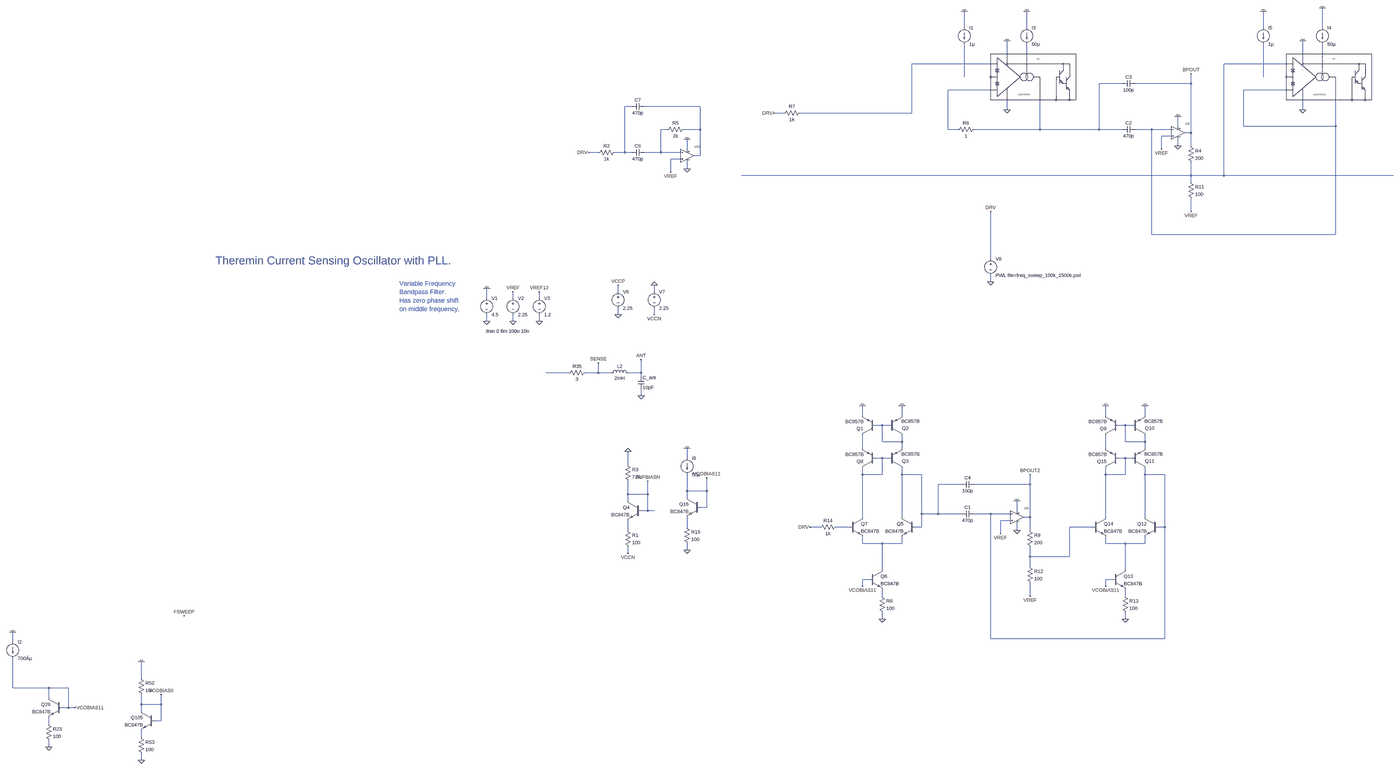
[diagram p0: schematic vco_and_lc_drive_v11.asc, whole sheet]
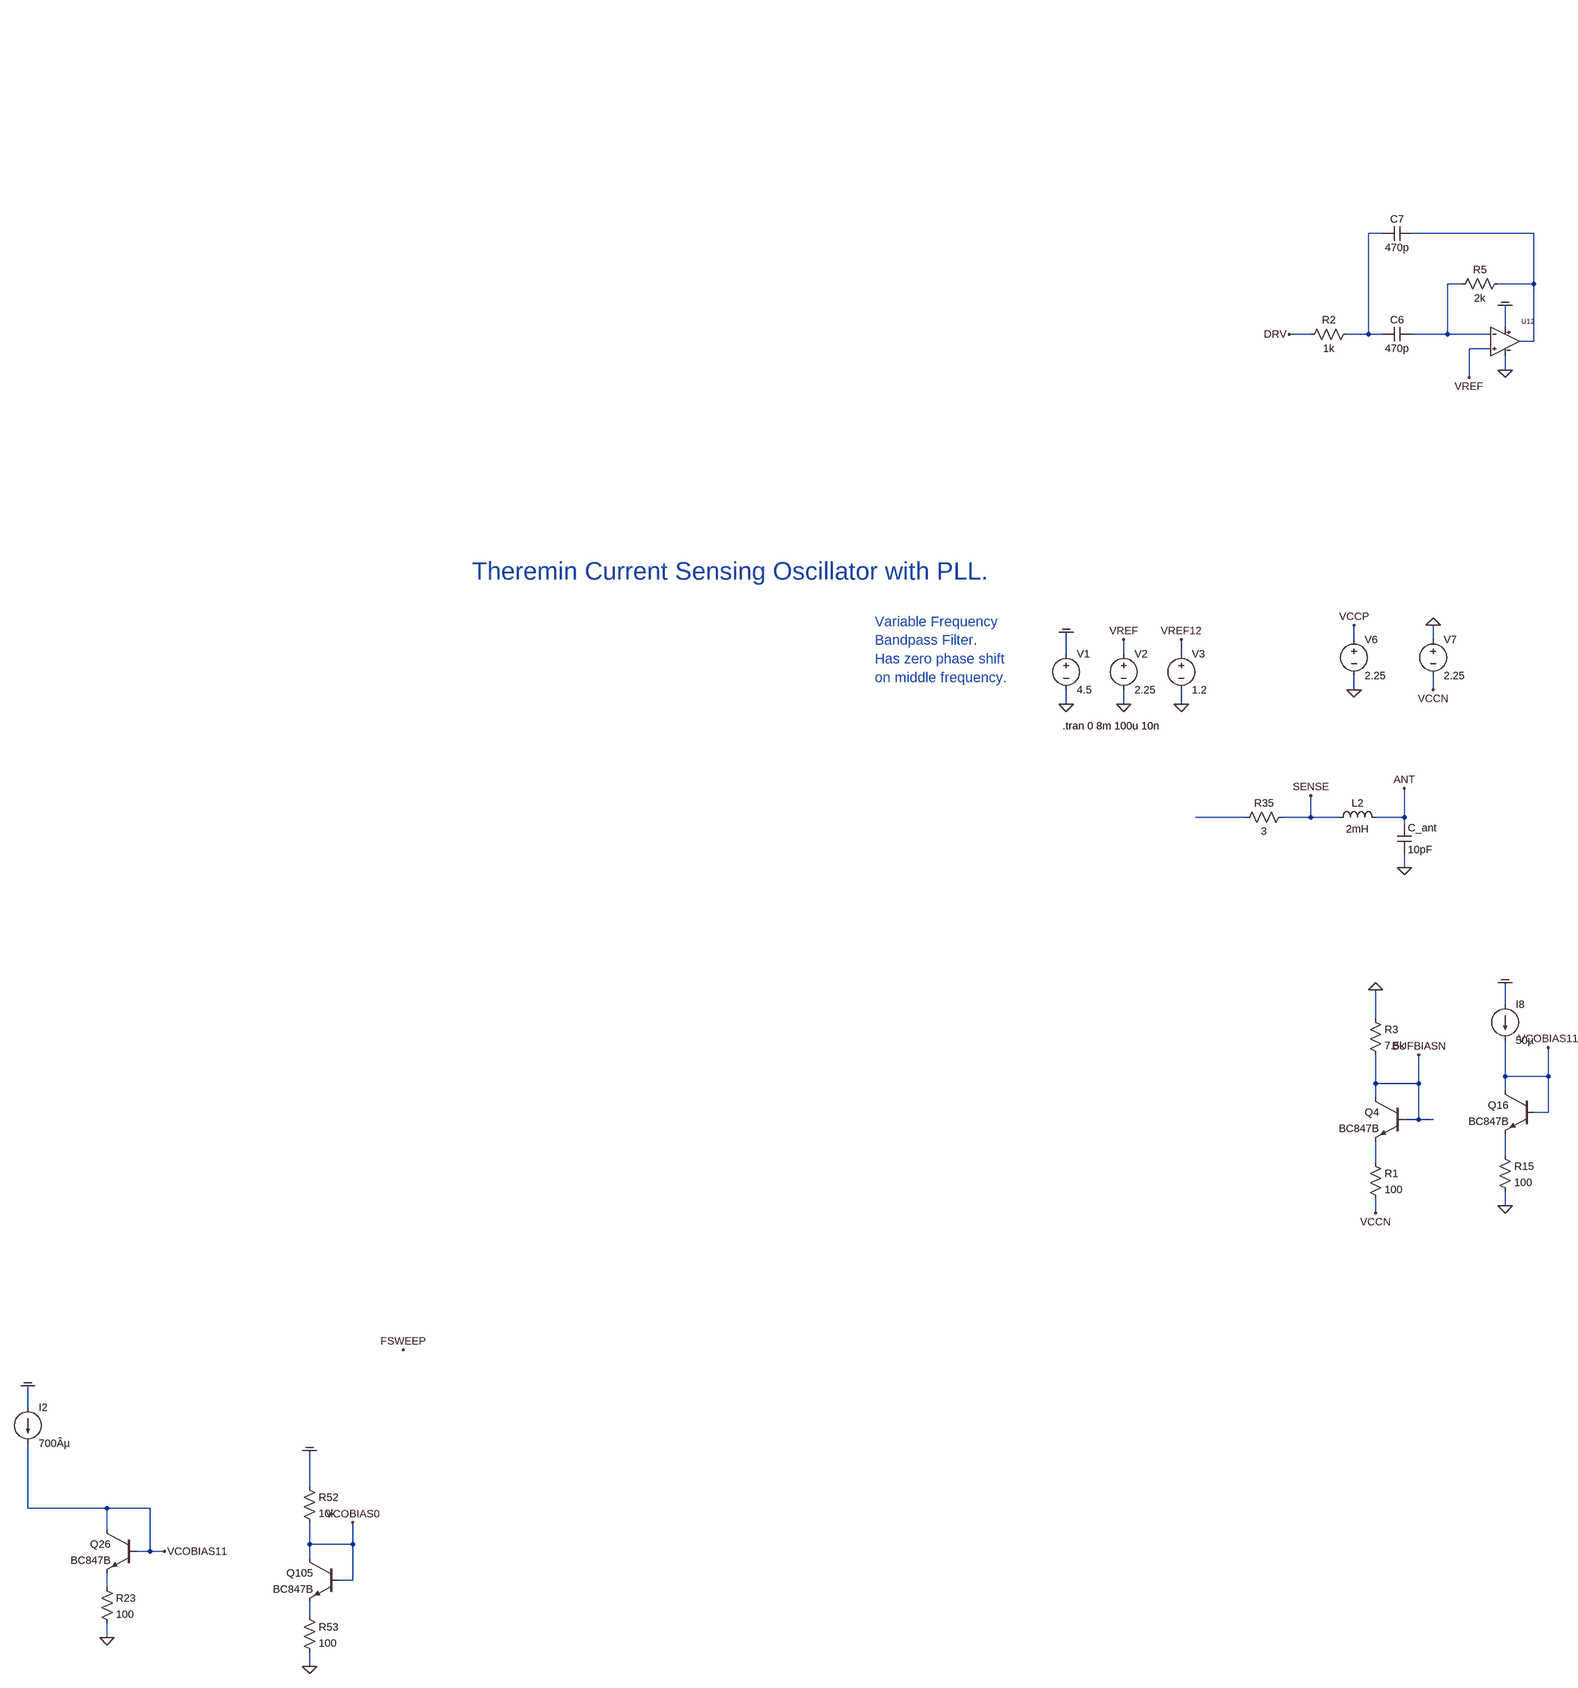
[diagram p1: schematic vco_and_lc_drive_v11.asc, part, row 1 of 1, column 1 of 2]
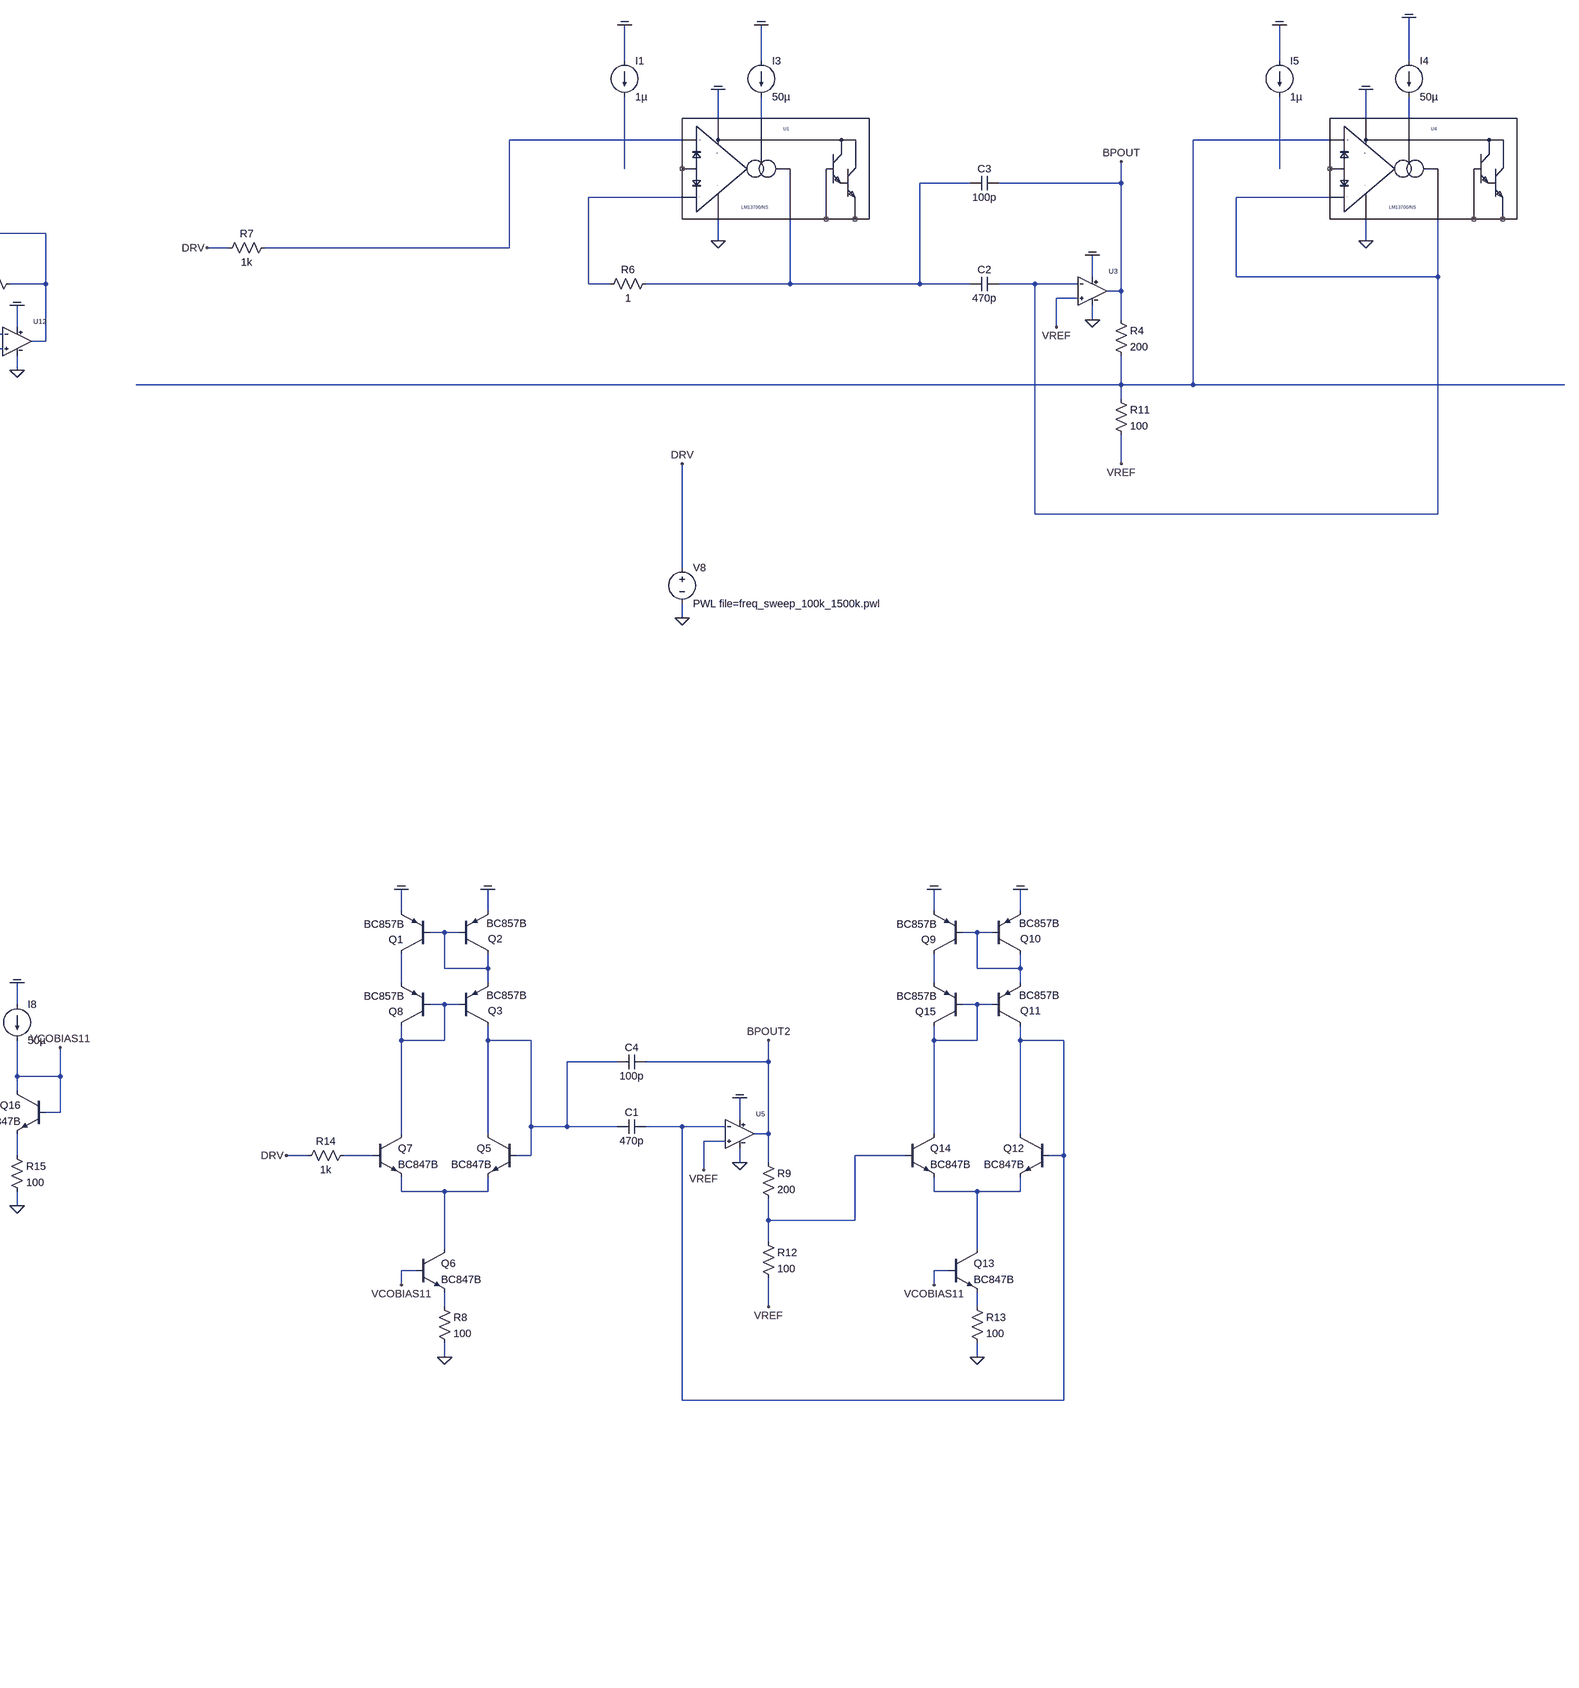
[diagram p2: schematic vco_and_lc_drive_v11.asc, part, row 1 of 1, column 2 of 2]
vco_and_lc_drive_v11.asc, the LTspice schematic file:
Version 4
SHEET 1 13504 24832
WIRE -2160 17680 -2160 17600
WIRE -1856 17680 -1856 17600
WIRE -704 17680 -704 17600
WIRE -416 17680 -416 17584
WIRE -1952 17808 -1952 17744
WIRE -1856 17808 -1856 17760
WIRE -512 17808 -512 17744
WIRE -416 17808 -416 17760
WIRE -2032 17856 -2416 17856
WIRE -592 17856 -896 17856
WIRE -2160 17920 -2160 17760
WIRE -704 17920 -704 17760
WIRE -1392 17952 -1504 17952
WIRE -1056 17952 -1056 17904
WIRE -1056 17952 -1328 17952
WIRE -2032 17984 -2240 17984
WIRE -592 17984 -800 17984
WIRE -4896 18064 -4928 18064
WIRE -4560 18064 -4832 18064
WIRE -1952 18080 -1952 18032
WIRE -512 18080 -512 18032
WIRE -3040 18096 -3088 18096
WIRE -2416 18096 -2416 17856
WIRE -2416 18096 -2960 18096
WIRE -1120 18160 -1120 18112
WIRE -800 18160 -800 17984
WIRE -352 18160 -352 18032
WIRE -352 18160 -800 18160
WIRE -4720 18176 -4752 18176
WIRE -4560 18176 -4560 18064
WIRE -4560 18176 -4640 18176
WIRE -2240 18176 -2240 17984
WIRE -2192 18176 -2240 18176
WIRE -1792 18176 -1792 18032
WIRE -1792 18176 -2112 18176
WIRE -1504 18176 -1504 17952
WIRE -1504 18176 -1792 18176
WIRE -1392 18176 -1504 18176
WIRE -1248 18176 -1328 18176
WIRE -1152 18176 -1248 18176
WIRE -1056 18192 -1056 17952
WIRE -1056 18192 -1088 18192
WIRE -1152 18208 -1200 18208
WIRE -1120 18256 -1120 18224
WIRE -1056 18256 -1056 18192
WIRE -4624 18272 -4624 18224
WIRE -1200 18272 -1200 18208
WIRE -5056 18288 -5104 18288
WIRE -4928 18288 -4928 18064
WIRE -4928 18288 -4976 18288
WIRE -4896 18288 -4928 18288
WIRE -4752 18288 -4752 18176
WIRE -4752 18288 -4832 18288
WIRE -4656 18288 -4752 18288
WIRE -4560 18304 -4560 18176
WIRE -4560 18304 -4592 18304
WIRE -4656 18320 -4704 18320
WIRE -4624 18368 -4624 18336
WIRE -4704 18384 -4704 18320
WIRE -1056 18400 -1056 18336
WIRE -1056 18400 -3328 18400
WIRE -896 18400 -896 17856
WIRE -896 18400 -1056 18400
WIRE 320 18400 -896 18400
WIRE -1056 18432 -1056 18400
WIRE -1056 18576 -1056 18512
WIRE -1248 18688 -1248 18176
WIRE -352 18688 -352 18160
WIRE -352 18688 -1248 18688
WIRE -2032 18880 -2032 18576
WIRE -2032 18992 -2032 18960
WIRE -4960 19040 -4960 19008
WIRE -4784 19040 -4784 19008
WIRE -5600 19072 -5600 19024
WIRE -5472 19072 -5472 19040
WIRE -5344 19072 -5344 19040
WIRE -4960 19152 -4960 19120
WIRE -4784 19152 -4784 19120
WIRE -5600 19184 -5600 19152
WIRE -5472 19184 -5472 19152
WIRE -5344 19184 -5344 19152
WIRE -5200 19440 -5312 19440
WIRE -5056 19440 -5056 19392
WIRE -5056 19440 -5120 19440
WIRE -4992 19440 -5056 19440
WIRE -4848 19440 -4848 19376
WIRE -4848 19440 -4912 19440
WIRE -4848 19456 -4848 19440
WIRE -4848 19552 -4848 19520
WIRE -2656 19648 -2656 19600
WIRE -2464 19648 -2464 19600
WIRE -1472 19648 -1472 19600
WIRE -1280 19648 -1280 19600
WIRE -2560 19696 -2592 19696
WIRE -2528 19696 -2560 19696
WIRE -1376 19696 -1408 19696
WIRE -1344 19696 -1376 19696
WIRE -2560 19776 -2560 19696
WIRE -2464 19776 -2464 19744
WIRE -2464 19776 -2560 19776
WIRE -1376 19776 -1376 19696
WIRE -1280 19776 -1280 19744
WIRE -1280 19776 -1376 19776
WIRE -2656 19808 -2656 19744
WIRE -2464 19808 -2464 19776
WIRE -1472 19808 -1472 19744
WIRE -1280 19808 -1280 19776
WIRE -4624 19856 -4624 19808
WIRE -2560 19856 -2592 19856
WIRE -2528 19856 -2560 19856
WIRE -1376 19856 -1408 19856
WIRE -1344 19856 -1376 19856
WIRE -4912 19888 -4912 19824
WIRE -2656 19936 -2656 19904
WIRE -2560 19936 -2560 19856
WIRE -2560 19936 -2656 19936
WIRE -2464 19936 -2464 19904
WIRE -2368 19936 -2464 19936
WIRE -1472 19936 -1472 19904
WIRE -1376 19936 -1376 19856
WIRE -1376 19936 -1472 19936
WIRE -1280 19936 -1280 19904
WIRE -1184 19936 -1280 19936
WIRE -2176 19984 -2288 19984
WIRE -1840 19984 -1840 19936
WIRE -1840 19984 -2112 19984
WIRE -4624 20016 -4624 19936
WIRE -4528 20016 -4528 19952
WIRE -4528 20016 -4624 20016
WIRE -4912 20032 -4912 19968
WIRE -4816 20032 -4816 19968
WIRE -4816 20032 -4912 20032
WIRE -4624 20048 -4624 20016
WIRE -4912 20064 -4912 20032
WIRE -4528 20096 -4528 20016
WIRE -4528 20096 -4560 20096
WIRE -4816 20112 -4816 20032
WIRE -4816 20112 -4848 20112
WIRE -4784 20112 -4816 20112
WIRE -1904 20112 -1904 20064
WIRE -2368 20128 -2368 19936
WIRE -2288 20128 -2288 19984
WIRE -2288 20128 -2368 20128
WIRE -2176 20128 -2288 20128
WIRE -2032 20128 -2112 20128
WIRE -1936 20128 -2032 20128
WIRE -2656 20144 -2656 19936
WIRE -2464 20144 -2464 19936
WIRE -1840 20144 -1840 19984
WIRE -1840 20144 -1872 20144
WIRE -1472 20144 -1472 19936
WIRE -1280 20144 -1280 19936
WIRE -1936 20160 -1984 20160
WIRE -4624 20192 -4624 20144
WIRE -2864 20192 -2912 20192
WIRE -2720 20192 -2784 20192
WIRE -2368 20192 -2368 20128
WIRE -2368 20192 -2400 20192
WIRE -1536 20192 -1648 20192
WIRE -1184 20192 -1184 19936
WIRE -1184 20192 -1216 20192
WIRE -4912 20208 -4912 20160
WIRE -1904 20208 -1904 20176
WIRE -1840 20208 -1840 20144
WIRE -1984 20224 -1984 20160
WIRE -2656 20272 -2656 20240
WIRE -2560 20272 -2656 20272
WIRE -2464 20272 -2464 20240
WIRE -2464 20272 -2560 20272
WIRE -1472 20272 -1472 20240
WIRE -1376 20272 -1472 20272
WIRE -1280 20272 -1280 20240
WIRE -1280 20272 -1376 20272
WIRE -4624 20304 -4624 20272
WIRE -4912 20320 -4912 20288
WIRE -1840 20336 -1840 20288
WIRE -1648 20336 -1648 20192
WIRE -1648 20336 -1840 20336
WIRE -1840 20384 -1840 20336
WIRE -2560 20400 -2560 20272
WIRE -1376 20400 -1376 20272
WIRE -2624 20448 -2656 20448
WIRE -1440 20448 -1472 20448
WIRE -2656 20480 -2656 20448
WIRE -1472 20480 -1472 20448
WIRE -2560 20528 -2560 20496
WIRE -1840 20528 -1840 20464
WIRE -1376 20528 -1376 20496
WIRE -2560 20640 -2560 20608
WIRE -1376 20640 -1376 20608
WIRE -2032 20736 -2032 20128
WIRE -1184 20736 -1184 20192
WIRE -1184 20736 -2032 20736
WIRE -8592 20752 -8592 20704
WIRE -7904 20928 -7904 20848
WIRE -8592 20976 -8592 20832
WIRE -8416 20976 -8592 20976
WIRE -8320 20976 -8416 20976
WIRE -8416 21024 -8416 20976
WIRE -7904 21056 -7904 21008
WIRE -7808 21056 -7808 21008
WIRE -7808 21056 -7904 21056
WIRE -8320 21072 -8320 20976
WIRE -8320 21072 -8352 21072
WIRE -8288 21072 -8320 21072
WIRE -7904 21088 -7904 21056
WIRE -7808 21136 -7808 21056
WIRE -7808 21136 -7840 21136
WIRE -8416 21152 -8416 21120
WIRE -7904 21216 -7904 21184
WIRE -8416 21264 -8416 21232
WIRE -7904 21328 -7904 21296
FLAG -5600 19184 0
FLAG -5600 19024 COM
FLAG -5472 19184 0
FLAG -5472 19040 VREF
FLAG -4848 19376 ANT
FLAG -5056 19392 SENSE
FLAG -5344 19184 0
FLAG -5344 19040 VREF12
FLAG -8288 21072 VCOBIAS11
FLAG -8416 21264 0
FLAG -7904 20848 COM
FLAG -7904 21328 0
FLAG -7808 21008 VCOBIAS0
FLAG -8592 20704 COM
FLAG -7696 20624 FSWEEP
FLAG -4960 19152 0
FLAG -4960 19008 VCCP
FLAG -4784 19008 0
FLAG -4784 19152 VCCN
FLAG -4912 20320 VCCN
FLAG -4912 19824 0
FLAG -4816 19968 BUFBIASN
FLAG -2032 18992 0
FLAG -2032 18576 DRV
FLAG -5104 18288 DRV
FLAG -4624 18368 0
FLAG -4624 18224 COM
FLAG -4704 18384 VREF
FLAG -1952 18080 0
FLAG -1952 17744 COM
FLAG -1120 18256 0
FLAG -1120 18112 COM
FLAG -1200 18272 VREF
FLAG -512 18080 0
FLAG -512 17744 COM
FLAG -1856 17600 COM
FLAG -416 17584 COM
FLAG -2160 17600 COM
FLAG -704 17600 COM
FLAG -1056 18576 VREF
FLAG -1056 17904 BPOUT
FLAG -3088 18096 DRV
FLAG -2656 19600 COM
FLAG -2464 19600 COM
FLAG -2656 20480 VCOBIAS11
FLAG -2560 20640 0
FLAG -1904 20208 0
FLAG -1904 20064 COM
FLAG -1984 20224 VREF
FLAG -1840 20528 VREF
FLAG -1840 19936 BPOUT2
FLAG -1472 19600 COM
FLAG -1280 19600 COM
FLAG -1472 20480 VCOBIAS11
FLAG -1376 20640 0
FLAG -2912 20192 DRV
FLAG -4848 19552 0
FLAG -4624 20304 0
FLAG -4528 19952 VCOBIAS11
FLAG -4624 19808 COM
SYMBOL voltage -5600 19056 R0
SYMATTR InstName V1
SYMATTR Value 4.5
SYMBOL Voltage -5472 19056 R0
SYMATTR InstName V2
SYMATTR Value 2.25
SYMBOL ind -5008 19456 R270
WINDOW 0 32 56 VTop 2
WINDOW 3 5 56 VBottom 2
SYMATTR InstName L2
SYMATTR Value 2mH
SYMATTR SpiceLine Rser=120 Cpar=1pF
SYMBOL Cap -4864 19456 R0
SYMATTR InstName C_ant
SYMATTR Value 10pF
SYMBOL Res -5216 19456 R270
WINDOW 0 32 56 VTop 2
WINDOW 3 0 56 VBottom 2
SYMATTR InstName R35
SYMATTR Value 3
SYMBOL Voltage -5344 19056 R0
SYMATTR InstName V3
SYMATTR Value 1.2
SYMBOL npn -8352 21024 M0
SYMATTR InstName Q26
SYMATTR Value BC847B
SYMBOL Res -8432 21136 R0
SYMATTR InstName R23
SYMATTR Value 100
SYMBOL npn -7840 21088 M0
SYMATTR InstName Q105
SYMATTR Value BC847B
SYMBOL Res -7920 20912 R0
SYMATTR InstName R52
SYMATTR Value 10k
SYMBOL Res -7920 21200 R0
SYMATTR InstName R53
SYMATTR Value 100
SYMBOL current -8592 20752 R0
SYMATTR InstName I2
SYMATTR Value 700Âµ
SYMBOL Voltage -4960 19024 R0
SYMATTR InstName V6
SYMATTR Value 2.25
SYMBOL Voltage -4784 19024 R0
SYMATTR InstName V7
SYMATTR Value 2.25
SYMBOL npn -4848 20064 M0
SYMATTR InstName Q4
SYMATTR Value BC847B
SYMBOL Res -4928 20192 R0
SYMATTR InstName R1
SYMATTR Value 100
SYMBOL Res -4928 19872 R0
SYMATTR InstName R3
SYMATTR Value 7.5k
SYMBOL Voltage -2032 18864 R0
SYMATTR InstName V8
SYMATTR Value PWL file=freq_sweep_100k_1500k.pwl
SYMBOL Res -4960 18272 R90
WINDOW 0 0 56 VBottom 2
WINDOW 3 32 56 VTop 2
SYMATTR InstName R2
SYMATTR Value 1k
SYMBOL Cap -4832 18272 R90
WINDOW 0 0 32 VBottom 2
WINDOW 3 32 32 VTop 2
SYMATTR InstName C6
SYMATTR Value 470p
SYMBOL Cap -4832 18048 R90
WINDOW 0 0 32 VBottom 2
WINDOW 3 32 32 VTop 2
SYMATTR InstName C7
SYMATTR Value 470p
SYMBOL Res -4624 18160 R90
WINDOW 0 0 56 VBottom 2
WINDOW 3 32 56 VTop 2
SYMATTR InstName R5
SYMATTR Value 2k
SYMBOL MCP6021 -4624 18304 R0
SYMATTR InstName U12
SYMBOL LM13700 -1952 17920 R0
SYMATTR InstName U1
SYMBOL current -1856 17680 R0
SYMATTR InstName I3
SYMATTR Value 50µ
SYMBOL Res -2096 18160 R90
WINDOW 0 0 56 VBottom 2
WINDOW 3 32 56 VTop 2
SYMATTR InstName R6
SYMATTR Value 1
SYMBOL Cap -1328 18160 R90
WINDOW 0 0 32 VBottom 2
WINDOW 3 32 32 VTop 2
SYMATTR InstName C2
SYMATTR Value 470p
SYMBOL Cap -1328 17936 R90
WINDOW 0 0 32 VBottom 2
WINDOW 3 32 32 VTop 2
SYMATTR InstName C3
SYMATTR Value 100p
SYMBOL MCP6021 -1120 18192 R0
SYMATTR InstName U3
SYMBOL LM13700 -512 17920 R0
SYMATTR InstName U4
SYMBOL current -416 17680 R0
SYMATTR InstName I4
SYMATTR Value 50µ
SYMBOL current -2160 17680 R0
SYMATTR InstName I1
SYMATTR Value 1µ
SYMBOL current -704 17680 R0
SYMATTR InstName I5
SYMATTR Value 1µ
SYMBOL Res -1072 18240 R0
SYMATTR InstName R4
SYMATTR Value 200
SYMBOL Res -1072 18416 R0
SYMATTR InstName R11
SYMATTR Value 100
SYMBOL Res -2944 18080 R90
WINDOW 0 0 56 VBottom 2
WINDOW 3 32 56 VTop 2
SYMATTR InstName R7
SYMATTR Value 1k
SYMBOL pnp -2592 19744 R180
WINDOW 0 60 32 Left 2
WINDOW 3 58 66 Left 2
SYMATTR InstName Q1
SYMATTR Value BC857B
SYMBOL pnp -2528 19744 M180
WINDOW 0 64 34 Left 2
WINDOW 3 61 68 Left 2
SYMATTR InstName Q2
SYMATTR Value BC857B
SYMBOL pnp -2528 19904 M180
WINDOW 0 64 34 Left 2
WINDOW 3 61 68 Left 2
SYMATTR InstName Q3
SYMATTR Value BC857B
SYMBOL npn -2400 20144 M0
SYMATTR InstName Q5
SYMATTR Value BC847B
SYMBOL npn -2624 20400 R0
SYMATTR InstName Q6
SYMATTR Value BC847B
SYMBOL npn -2720 20144 R0
SYMATTR InstName Q7
SYMATTR Value BC847B
SYMBOL Res -2576 20512 R0
SYMATTR InstName R8
SYMATTR Value 100
SYMBOL pnp -2592 19904 R180
WINDOW 0 60 32 Left 2
WINDOW 3 58 66 Left 2
SYMATTR InstName Q8
SYMATTR Value BC857B
SYMBOL Cap -2112 20112 R90
WINDOW 0 0 32 VBottom 2
WINDOW 3 32 32 VTop 2
SYMATTR InstName C1
SYMATTR Value 470p
SYMBOL Cap -2112 19968 R90
WINDOW 0 0 32 VBottom 2
WINDOW 3 32 32 VTop 2
SYMATTR InstName C4
SYMATTR Value 100p
SYMBOL MCP6021 -1904 20144 R0
SYMATTR InstName U5
SYMBOL Res -1856 20192 R0
SYMATTR InstName R9
SYMATTR Value 200
SYMBOL Res -1856 20368 R0
SYMATTR InstName R12
SYMATTR Value 100
SYMBOL pnp -1408 19744 R180
WINDOW 0 60 32 Left 2
WINDOW 3 58 66 Left 2
SYMATTR InstName Q9
SYMATTR Value BC857B
SYMBOL pnp -1344 19744 M180
WINDOW 0 64 34 Left 2
WINDOW 3 61 68 Left 2
SYMATTR InstName Q10
SYMATTR Value BC857B
SYMBOL pnp -1344 19904 M180
WINDOW 0 64 34 Left 2
WINDOW 3 61 68 Left 2
SYMATTR InstName Q11
SYMATTR Value BC857B
SYMBOL npn -1216 20144 M0
SYMATTR InstName Q12
SYMATTR Value BC847B
SYMBOL npn -1440 20400 R0
SYMATTR InstName Q13
SYMATTR Value BC847B
SYMBOL npn -1536 20144 R0
SYMATTR InstName Q14
SYMATTR Value BC847B
SYMBOL Res -1392 20512 R0
SYMATTR InstName R13
SYMATTR Value 100
SYMBOL pnp -1408 19904 R180
WINDOW 0 60 32 Left 2
WINDOW 3 58 66 Left 2
SYMATTR InstName Q15
SYMATTR Value BC857B
SYMBOL Res -2768 20176 R90
WINDOW 0 0 56 VBottom 2
WINDOW 3 32 56 VTop 2
SYMATTR InstName R14
SYMATTR Value 1k
SYMBOL npn -4560 20048 M0
SYMATTR InstName Q16
SYMATTR Value BC847B
SYMBOL Res -4640 20176 R0
SYMATTR InstName R15
SYMATTR Value 100
SYMBOL current -4624 19856 R0
SYMATTR InstName I8
SYMATTR Value 50µ
TEXT -5608 19232 Left 2 !.tran 0 8m 100u 10n
TEXT -7336 18888 Left 5 ;Theremin Current Sensing Oscillator with PLL.
TEXT -6440 19000 Left 3 ;Variable Frequency \nBandpass Filter.\nHas zero phase shift \non middle frequency.

The netlist it stands for:
* vco_and_lc_drive_v11.asc
V1 COM 0 4.5
V2 VREF 0 2.25
L2 SENSE ANT 2mH Rser=120 Cpar=1pF
C_ant ANT 0 10pF
R35 N013 SENSE 3
V3 VREF12 0 1.2
Q26 VCOBIAS11 VCOBIAS11 N030 0 BC847B
R23 N030 0 100
Q105 VCOBIAS0 VCOBIAS0 N031 0 BC847B
R52 COM VCOBIAS0 10k
R53 N031 0 100
I2 COM VCOBIAS11 700Âµ
V6 VCCP 0 2.25
V7 0 VCCN 2.25
Q4 BUFBIASN BUFBIASN N025 0 BC847B
R1 N025 VCCN 100
R3 0 BUFBIASN 7.5k
V8 DRV 0 PWL file=freq_sweep_100k_1500k.pwl
R2 N010 DRV 1k
C6 N012 N010 470p
C7 N011 N010 470p
R5 N011 N012 2k
XU12 VREF N012 COM 0 N011 MCP6021  ; pins In+ In- V+ V- OUT
XU1 N001 NC_01 N003 N008 N007 0 NC_02 NC_03 COM LM13700/NS  ; pins Ibias Dio_bias in+ in- out V- buf_in buf_out V+
I3 COM N001 50µ
R6 N007 N008 1
C2 N009 N007 470p
C3 BPOUT N007 100p
XU3 VREF N009 COM 0 BPOUT MCP6021  ; pins In+ In- V+ V- OUT
XU4 N002 NC_04 N004 N009 N009 0 NC_05 NC_06 COM LM13700/NS  ; pins Ibias Dio_bias in+ in- out V- buf_in buf_out V+
I4 COM N002 50µ
I1 COM N005 1µ
I5 COM N006 1µ
R4 BPOUT N004 200
R11 N004 VREF 100
R7 N003 DRV 1k
Q1 N016 N014 COM 0 BC857B
Q2 N014 N014 COM 0 BC857B
Q3 N020 N018 N014 0 BC857B
Q5 N020 N020 N026 0 BC847B
Q6 N026 VCOBIAS11 N028 0 BC847B
Q7 N018 N023 N026 0 BC847B
R8 N028 0 100
Q8 N018 N018 N016 0 BC857B
C1 N021 N020 470p
C4 BPOUT2 N020 100p
XU5 VREF N021 COM 0 BPOUT2 MCP6021  ; pins In+ In- V+ V- OUT
R9 BPOUT2 N024 200
R12 N024 VREF 100
Q9 N017 N015 COM 0 BC857B
Q10 N015 N015 COM 0 BC857B
Q11 N021 N019 N015 0 BC857B
Q12 N021 N021 N027 0 BC847B
Q13 N027 VCOBIAS11 N029 0 BC847B
Q14 N019 N024 N027 0 BC847B
R13 N029 0 100
Q15 N019 N019 N017 0 BC857B
R14 N023 DRV 1k
Q16 VCOBIAS11 VCOBIAS11 N022 0 BC847B
R15 N022 0 100
I8 COM VCOBIAS11 50µ
.model NPN NPN
.model PNP PNP
.lib standard.bjt
.tran 0 8m 100u 10n
* Theremin Current Sensing Oscillator with PLL.
* Variable Frequency
* Bandpass Filter.
* Has zero phase shift
* on middle frequency.
.lib MCP6021.cir
.lib ns_models.lib
.backanno
.end